# Altium schematic sheet Expan.schdoc
size 308 x 211 mm
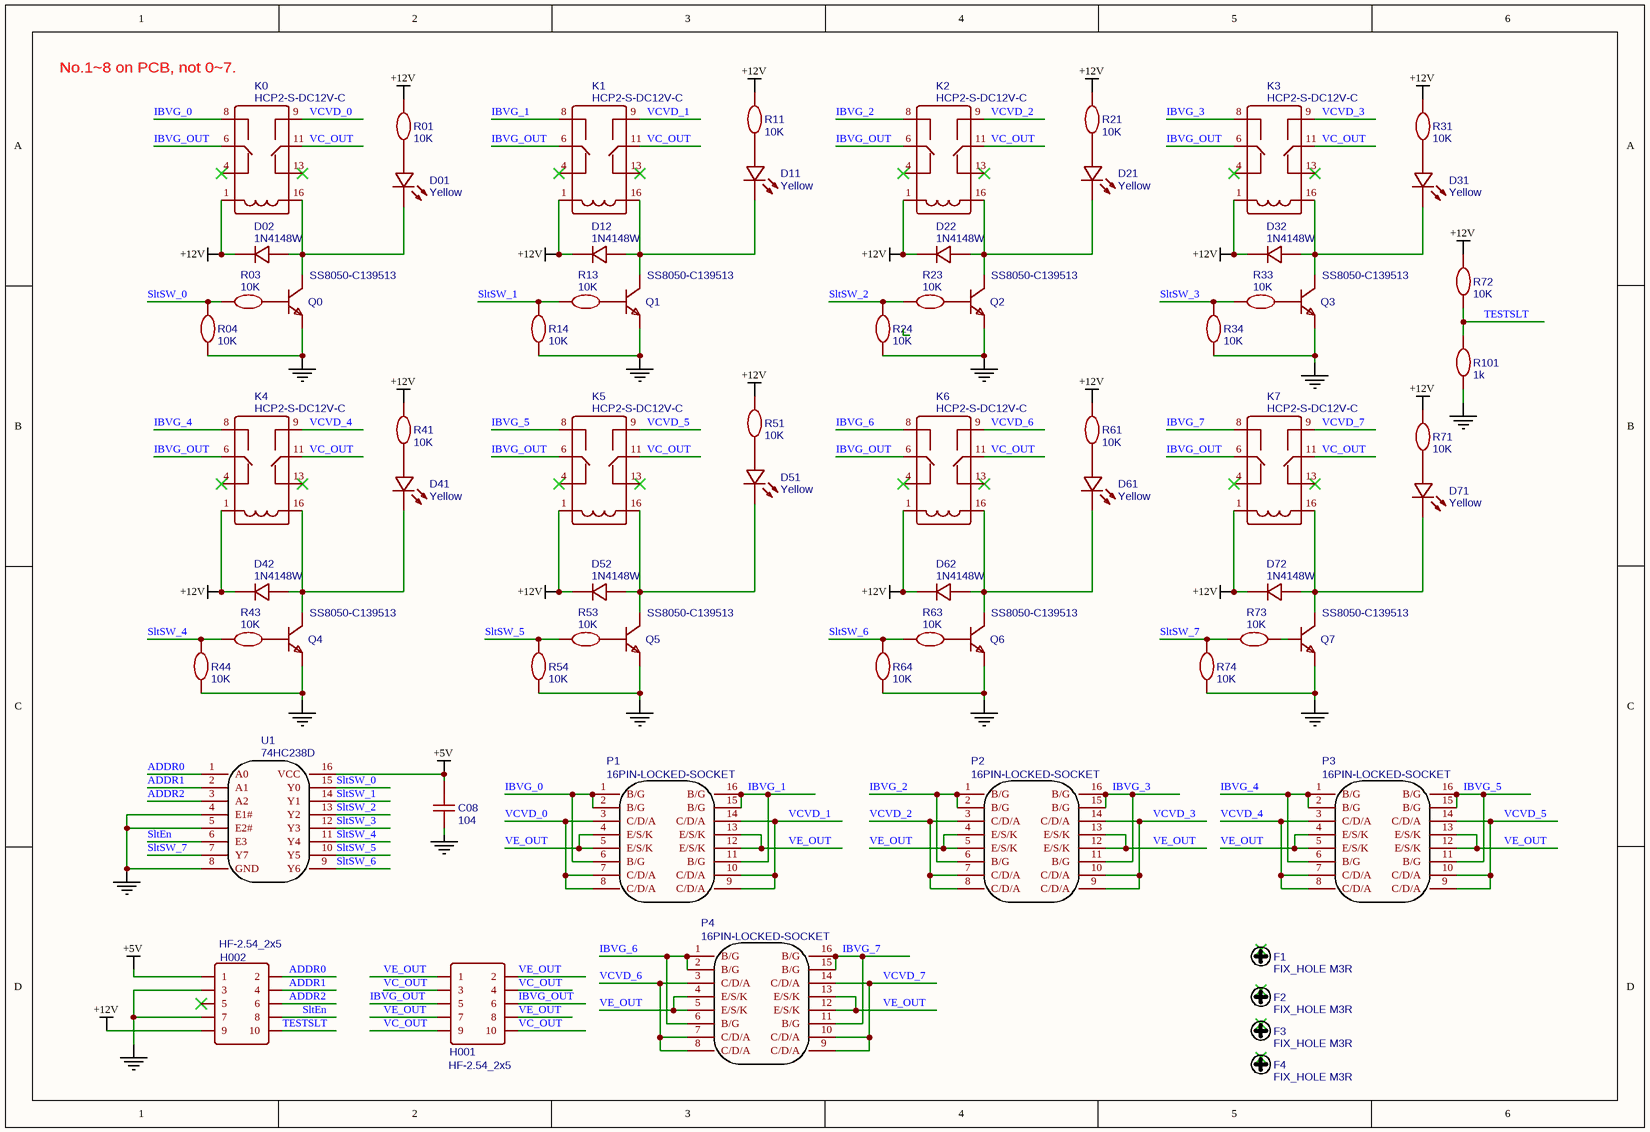
[diagram p0: Expan.schdoc]

## Parts
C08  104  [C0805]
D01  Yellow  [LED-TH_BD4.0-P2.54-FD]
D02  1N4148W  [SOD-123_L2.8-W1.8-LS3.7-FD]
D11  Yellow  [LED-TH_BD4.0-P2.54-FD]
D12  1N4148W  [SOD-123_L2.8-W1.8-LS3.7-FD]
D21  Yellow  [LED-TH_BD4.0-P2.54-FD]
D22  1N4148W  [SOD-123_L2.8-W1.8-LS3.7-FD]
D31  Yellow  [LED-TH_BD4.0-P2.54-FD]
D32  1N4148W  [SOD-123_L2.8-W1.8-LS3.7-FD]
D41  Yellow  [LED-TH_BD4.0-P2.54-FD]
D42  1N4148W  [SOD-123_L2.8-W1.8-LS3.7-FD]
D51  Yellow  [LED-TH_BD4.0-P2.54-FD]
D52  1N4148W  [SOD-123_L2.8-W1.8-LS3.7-FD]
D61  Yellow  [LED-TH_BD4.0-P2.54-FD]
D62  1N4148W  [SOD-123_L2.8-W1.8-LS3.7-FD]
D71  Yellow  [LED-TH_BD4.0-P2.54-FD]
D72  1N4148W  [SOD-123_L2.8-W1.8-LS3.7-FD]
F1  FIX_HOLE M3R  [FIXHOLE_M3R]
F2  FIX_HOLE M3R  [FIXHOLE_M3R]
F3  FIX_HOLE M3R  [FIXHOLE_M3R]
F4  FIX_HOLE M3R  [FIXHOLE_M3R]
H001  HF-2.54_2x5  [HDR-TH_10P-P2.54-V-R2-C5-S2.54]
H002  HF-2.54_2x5  [HDR-TH_10P-P2.54-V-R2-C5-S2.54]
K0  HCP2-S-DC12V-C  [RELAY-HCP2-S-C]
K1  HCP2-S-DC12V-C  [RELAY-HCP2-S-C]
K2  HCP2-S-DC12V-C  [RELAY-HCP2-S-C]
K3  HCP2-S-DC12V-C  [RELAY-HCP2-S-C]
K4  HCP2-S-DC12V-C  [RELAY-HCP2-S-C]
K5  HCP2-S-DC12V-C  [RELAY-HCP2-S-C]
K6  HCP2-S-DC12V-C  [RELAY-HCP2-S-C]
K7  HCP2-S-DC12V-C  [RELAY-HCP2-S-C]
P1  16PIN-LOCKED-SOCKET  [16PIN-LOCKED-SOCKET]
P2  16PIN-LOCKED-SOCKET  [16PIN-LOCKED-SOCKET]
P3  16PIN-LOCKED-SOCKET  [16PIN-LOCKED-SOCKET]
P4  16PIN-LOCKED-SOCKET  [16PIN-LOCKED-SOCKET]
Q0  SS8050-C139513  [SOT-23-3_L2.9-W1.3-P1.90-LS2.4-BR]
Q1  SS8050-C139513  [SOT-23-3_L2.9-W1.3-P1.90-LS2.4-BR]
Q2  SS8050-C139513  [SOT-23-3_L2.9-W1.3-P1.90-LS2.4-BR]
Q3  SS8050-C139513  [SOT-23-3_L2.9-W1.3-P1.90-LS2.4-BR]
Q4  SS8050-C139513  [SOT-23-3_L2.9-W1.3-P1.90-LS2.4-BR]
Q5  SS8050-C139513  [SOT-23-3_L2.9-W1.3-P1.90-LS2.4-BR]
Q6  SS8050-C139513  [SOT-23-3_L2.9-W1.3-P1.90-LS2.4-BR]
Q7  SS8050-C139513  [SOT-23-3_L2.9-W1.3-P1.90-LS2.4-BR]
R01  10K  [R0805]
R03  10K  [R0805]
R04  10K  [R0805]
R11  10K  [R0805]
R13  10K  [R0805]
R14  10K  [R0805]
R21  10K  [R0805]
R23  10K  [R0805]
R24  10K  [R0805]
R31  10K  [R0805]
R33  10K  [R0805]
R34  10K  [R0805]
R41  10K  [R0805]
R43  10K  [R0805]
R44  10K  [R0805]
R51  10K  [R0805]
R53  10K  [R0805]
R54  10K  [R0805]
R61  10K  [R0805]
R63  10K  [R0805]
R64  10K  [R0805]
R71  10K  [R0805]
R72  10K  [R0805]
R73  10K  [R0805]
R74  10K  [R0805]
R101  1k  [R0805]
U1  74HC238D  [SOIC-16_L9.9-W3.9-P1.27-LS6.0-BL]

## Nets
+5V: C08.2 H002.1 U1.16(VCC)
+12V: D02.2(K) D12.2(K) D22.2(K) D32.2(K) D42.2(K) D52.2(K) D62.2(K) D72.2(K) H002.9 K0.1 K1.1 K2.1 K3.1 K4.1 K5.1 K6.1 K7.1 R01.1 R11.1 R21.1 R31.1 R41.1 R51.1 R61.1 R71.1 R72.1
GND: C08.1 H002.3 H002.7 Q0.2(E) Q1.2(E) Q2.2(E) Q3.2(E) Q4.2(E) Q5.2(E) Q6.2(E) Q7.2(E) R04.2 R14.2 R24.2 R34.2 R44.2 R54.2 R64.2 R74.2 R101.2 U1.4(E1#) U1.5(E2#) U1.8(GND)
ADDR0: H002.2 U1.1(A0)
ADDR1: H002.4 U1.2(A1)
ADDR2: H002.6 U1.3(A2)
IBVG_0: K0.8 P1.1(B/G) P1.2(B/G) P1.6(B/G)
IBVG_1: K1.8 P1.11(B/G) P1.15(B/G) P1.16(B/G)
IBVG_2: K2.8 P2.1(B/G) P2.2(B/G) P2.6(B/G)
IBVG_3: K3.8 P2.11(B/G) P2.15(B/G) P2.16(B/G)
IBVG_4: K4.8 P3.1(B/G) P3.2(B/G) P3.6(B/G)
IBVG_5: K5.8 P3.11(B/G) P3.15(B/G) P3.16(B/G)
IBVG_6: K6.8 P4.1(B/G) P4.2(B/G) P4.6(B/G)
IBVG_7: K7.8 P4.11(B/G) P4.15(B/G) P4.16(B/G)
IBVG_OUT: H001.5 H001.6 K0.6 K1.6 K2.6 K3.6 K4.6 K5.6 K6.6 K7.6
SltEn: H002.8 U1.6(E3)
SltSW_0: R03.2 R04.1 U1.15(Y0)
SltSW_1: R13.2 R14.1 U1.14(Y1)
SltSW_2: R23.2 R24.1 U1.13(Y2)
SltSW_3: R33.2 R34.1 U1.12(Y3)
SltSW_4: R43.2 R44.1 U1.11(Y4)
SltSW_5: R53.2 R54.1 U1.10(Y5)
SltSW_6: R63.2 R64.1 U1.9(Y6)
SltSW_7: R73.2 R74.1 U1.7(Y7)
TESTSLT: H002.10 R72.2 R101.1
VC_OUT: H001.3 H001.4 H001.9 H001.10 K0.11 K1.11 K2.11 K3.11 K4.11 K5.11 K6.11 K7.11
VCVD_0: K0.9 P1.3(C/D/A) P1.7(C/D/A) P1.8(C/D/A)
VCVD_1: K1.9 P1.9(C/D/A) P1.10(C/D/A) P1.14(C/D/A)
VCVD_2: K2.9 P2.3(C/D/A) P2.7(C/D/A) P2.8(C/D/A)
VCVD_3: K3.9 P2.9(C/D/A) P2.10(C/D/A) P2.14(C/D/A)
VCVD_4: K4.9 P3.3(C/D/A) P3.7(C/D/A) P3.8(C/D/A)
VCVD_5: K5.9 P3.9(C/D/A) P3.10(C/D/A) P3.14(C/D/A)
VCVD_6: K6.9 P4.3(C/D/A) P4.7(C/D/A) P4.8(C/D/A)
VCVD_7: K7.9 P4.9(C/D/A) P4.10(C/D/A) P4.14(C/D/A)
VE_OUT: H001.1 H001.2 H001.7 H001.8 P1.4(E/S/K) P1.5(E/S/K) P1.12(E/S/K) P1.13(E/S/K) P2.4(E/S/K) P2.5(E/S/K) P2.12(E/S/K) P2.13(E/S/K) P3.4(E/S/K) P3.5(E/S/K) P3.12(E/S/K) P3.13(E/S/K) P4.4(E/S/K) P4.5(E/S/K) P4.12(E/S/K) P4.13(E/S/K)
NetD01_1: D01.1(A) R01.2
NetD01_2: D01.2(K) D02.1(A) K0.16 Q0.3(C)
NetD11_1: D11.1(A) R11.2
NetD11_2: D11.2(K) D12.1(A) K1.16 Q1.3(C)
NetD21_1: D21.1(A) R21.2
NetD21_2: D21.2(K) D22.1(A) K2.16 Q2.3(C)
NetD31_1: D31.1(A) R31.2
NetD31_2: D31.2(K) D32.1(A) K3.16 Q3.3(C)
NetD41_1: D41.1(A) R41.2
NetD41_2: D41.2(K) D42.1(A) K4.16 Q4.3(C)
NetD51_1: D51.1(A) R51.2
NetD51_2: D51.2(K) D52.1(A) K5.16 Q5.3(C)
NetD61_1: D61.1(A) R61.2
NetD61_2: D61.2(K) D62.1(A) K6.16 Q6.3(C)
NetD71_1: D71.1(A) R71.2
NetD71_2: D71.2(K) D72.1(A) K7.16 Q7.3(C)
NetQ0_1: Q0.1(B) R03.1
NetQ1_1: Q1.1(B) R13.1
NetQ2_1: Q2.1(B) R23.1
NetQ3_1: Q3.1(B) R33.1
NetQ4_1: Q4.1(B) R43.1
NetQ5_1: Q5.1(B) R53.1
NetQ6_1: Q6.1(B) R63.1
NetQ7_1: Q7.1(B) R73.1

Not connected (* = marked no-connect by the designer): F1 0*; F2 0*; F3 0*; F4 0*; H002 5*; K0 4* 13*; K1 4* 13*; K2 4* 13*; K3 4* 13*; K4 4* 13*; K5 4* 13*; K6 4* 13*; K7 4* 13*

## Notes on the sheet
- (near K0) No.1~8 on PCB, not 0~7.

## Library data of the parts
C08 = 104: nameAlias: Value(F); spicePre: C; spiceSymbolName: Cap_0805_US
D01 D11 D21 D31 D41 D51 D61 D71 = Yellow: BOM_Manufacturer: TONYU; BOM_Manufacturer Part: DY-204URD/SN-A3(EL); Contributor: LCSC; BOM_Supplier: LCSC; BOM_Supplier Part: C396687; spicePre: L; spiceSymbolName: DY-204URD/SN-A3(EL)
D02 D12 D22 D32 D42 D52 D62 D72 = 1N4148W: BOM_Manufacturer: SEMTECH; SMT Type: Basic; BOM_Supplier: LCSC; BOM_Manufacturer Part: 1N4148W; image: //image.lceda.cn/szlcsc/C81598.jpg; BOM_Supplier Part: C81598; BOM_LCSC Assembly: Yes; spicePre: D
F1-F4 = FIX_HOLE M3R: Contributor: JM共享库; spicePre: F; spiceSymbolName: FIX_HOLE M3R
H001 H002 = HF-2.54_2x5: BOM_Manufacturer: Ckmtw; BOM_Manufacturer Part: 220S-2*5P H=8.5MM Ytype Gold-plated; BOM_Supplier: LCSC; BOM_Supplier Part: C124423; spicePre: H; spiceSymbolName: Header-Female-2.54_2x5
K0-K7 = HCP2-S-DC12V-C: BOM_Manufacturer: Zhejiang HKE; Contributor: LCSC; BOM_Supplier: LCSC; BOM_Supplier Part: C125698; BOM_Manufacturer Part: HCP2-S-DC12V-C; spicePre: K; spiceSymbolName: HCP2-S-DC12V-C
P1-P4 = 16PIN-LOCKED-SOCKET: Contributor: XTX_AE; spicePre: P
Q0-Q7 = SS8050-C139513: BOM_Manufacturer: LGE; BOM_Manufacturer Part: SS8050; Contributor: LCSC; BOM_Supplier: LCSC; BOM_Supplier Part: C402304; spicePre: Q
R01 R03 R04 R11 R13 R14 R21 R23 R24 R31 R33 R34 R41 R43 R44 R51 R53 R54 R61 R63 R64 R71-R74 = 10K: nameAlias: Value(Ω); spicePre: R; spiceSymbolName: Res_0805(1/8W)_EU
R101 = 1k: nameAlias: Value(Ω); spicePre: R; spiceSymbolName: Res_0805(1/8W)_EU
U1 = 74HC238D: BOM_Manufacturer: PHILIPS; SMT Type: Extend; BOM_Supplier: LCSC; BOM_Manufacturer Part: 74HC238D; image: //image.lceda.cn/szlcsc/C5620.jpg; BOM_Supplier Part: C5620; BOM_LCSC Assembly: Yes; spicePre: U